# Altium schematic sheet Power_Supply_AMP.SchDoc
size A4; CompanyName: Technische Hochschule Nürnberg Georg Simon Ohm; Address1: Fürther Straße 250; Address2: 90429 Nürnberg; Address3: GERMANY; SheetNumber: 3; SheetTotal: 5; CompanyName2: Institut ELSYS
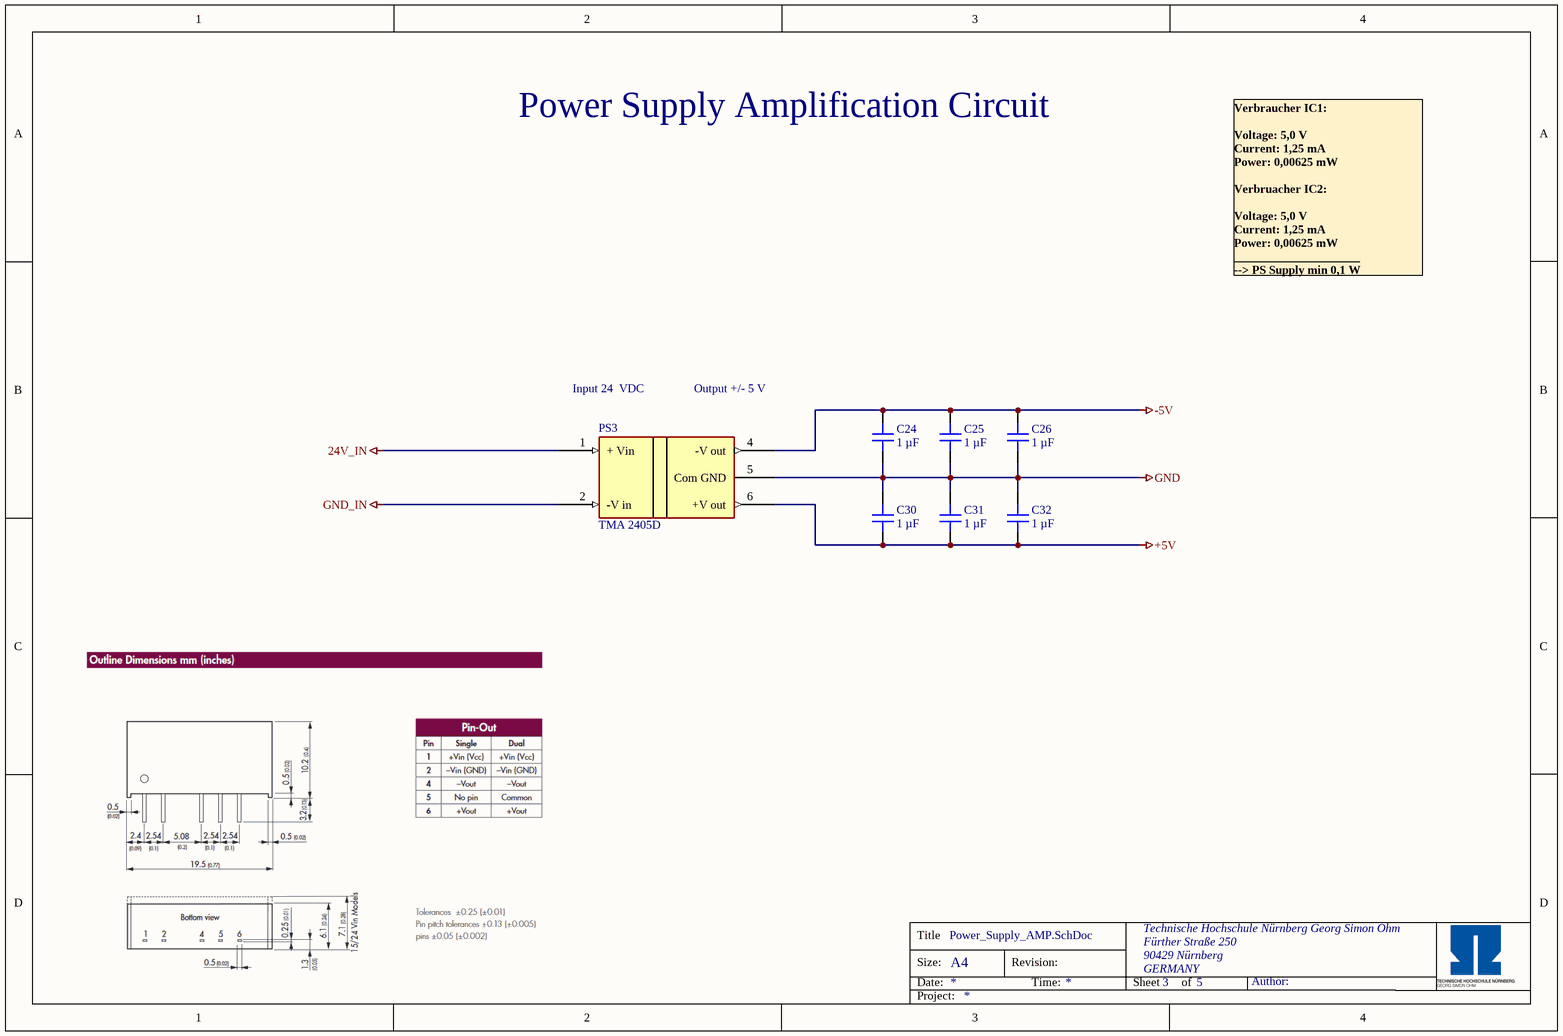
[diagram p0: Power_Supply_AMP.SchDoc]

## Parts
C24  1 µF  [C_0603]
C25  1 µF  [C_0603]
C26  1 µF  [C_0603]
C30  1 µF  [C_0603]
C31  1 µF  [C_0603]
C32  1 µF  [C_0603]
PS3  TMA 2405D  [TMA 2405D]

## Nets
24V_IN: PS3.1(+_Vin)
+5V: C30.1 C31.1 C32.1 PS3.6(+V_out)
-5V: C24.2 C25.2 C26.2 PS3.4(-V_out)
GND: C24.1 C25.1 C26.1 C30.2 C31.2 C32.2 PS3.5(Com_GND)
GND_IN: PS3.2(-V_in)

## Notes on the sheet
- Power Supply Amplification Circuit
- Verbraucher IC1:
  Voltage: 5,0 V
  Current: 1,25 mA
  Power: 0,00625 mW
  Verbruacher IC2:
  Voltage: 5,0 V
  Current: 1,25 mA
  Power: 0,00625 mW
  _____________________
  --> PS Supply min 0,1 W
- Input 24  VDC
- Output +/- 5 V
- Title
- Size:
- Date:
- A4
- Revision:
- Time:
- Sheet
- of
- Author:
- Project:

## Library data of the parts
C24-C26 C30-C32 = CL10A105KB8NNNC: 50V 1uF X5R ±10% 0603  Multilayer Ceramic Capacitors MLCC - SMD/SMT ROHS; Manufacturer: Samsung Electro-Mechanics; Voltage Rating: 50 VDC; Created from: MGremer; Supplier 1: LCSC; Supplier Part Number 1: C15849; Manufacturer Part Number: CL10A105KB8NNNC; Value: 1 µF; PartID: 5; Created On: 20.12.2020 13:54:13; ComponentLink1Description: Datasheet; ComponentLink1URL: https://datasheet.lcsc.com/lcsc/1810261812_Samsung-Electro-Mechanics-CL10A105KB8NNNC_C15849.pdf; Component Type: Capacitor 0603; Device Package: 0603; Last Updated: 28.11.2022 17:23:01; Mounting Type: SMD; Operating Temperature: -55 - 85°C; Series: M; Type: Capacitor; Tolerance: 10 %; Live Cycle Status: 1; LCSC Part Number: C15849; Stock number: Labor SMD Container
PS3 = TMA 2405D: Isolierte DC/DC-Wandler – Durchsteckmontage Product Type: DC/DC; Package Style: SIP; Output Power (W): 1; Input Voltage: 24 VDC +/-10%; Output 1 (Vdc): 5; Output 2 (Vdc): -5; Output 3 (Vdc): N/A; Parameter 1: *; Supplier 1: Mouser; Supplier Part Number 1: 490-PGNM1-S24-S5-S